# EAGLE design EAT0004 (EAGLE 7.2.0)
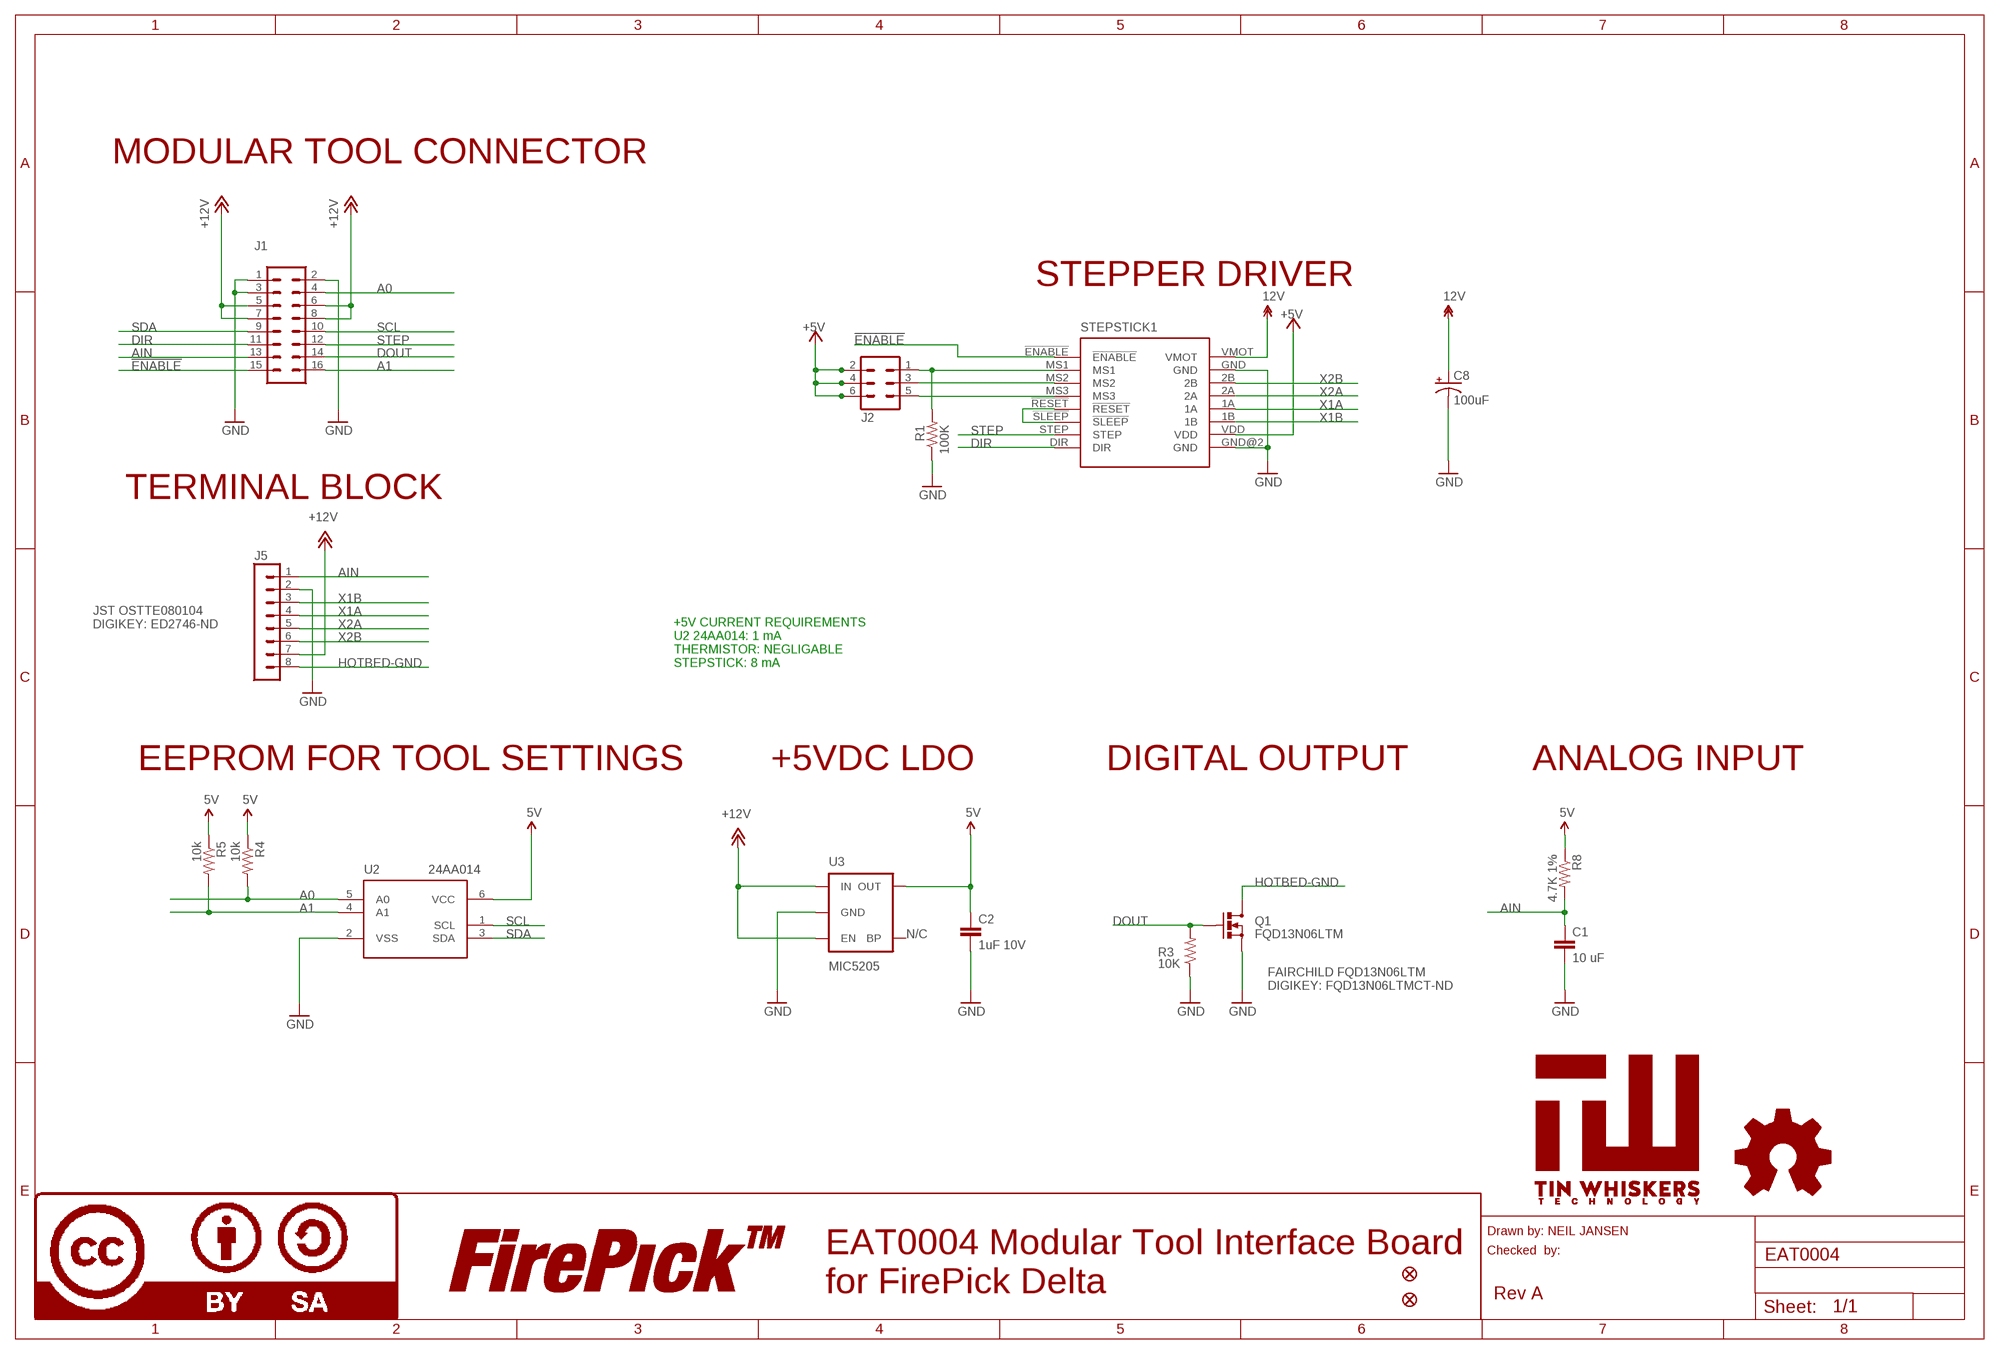
[diagram p0: schematic, sheet 1]

## Parts
C1  10 uF  CAP0805  [0805]
C2  1uF 10V  CAP0805  [0805]
C8  100uF  CPOL-USD  [PANASONIC_D]
FID1  FIDUCIAL  [FIDUCIAL]
FID2  FIDUCIAL  [FIDUCIAL]
J1  CONN-RECT-16PIN-2ROWSIDE  [CONN-RECT-2.54MM-16PIN-2ROW-SIDE]
J2  MA03-2  [MA03-2]
J5  CONN-OSTTE1201X4  [CONN-OSTTE1201X4]
LOGO1  LOGO-OSHWSMALL  [LOGO-OSHW-SMALL]
LOGO4  LOGO-FIREPICKMEDIUM  [LOGO-FIREPICK-MEDIUM]
LOGO6  LOGO-CC-BY-SAMEDIUM  [LOGO-CC-BY-SA-MEDIUM]
Q1  FQD13N06LTM  MOSFET-NCHANNELFDD8580  [DPAK]
R1  100K  RESISTOR0805-RES  [0805]
R3  10K  RESISTOR0805-RES  [0805]
R4  10k  RESISTOR0805-RES  [0805]
R5  10k  RESISTOR0805-RES  [0805]
R8  4.7K 1%  RESISTOR0805-RES  [0805]
STEPSTICK1  STEPSTICK  [STEPSTICK]
U2  24AA014  IC-24AA014  [SOT23-6]
U3  MIC5205  MIC52055V  [SOT23-5]
U$3  TIN-WHISKERSSMALL  [TIN-WHISKERS-SMALL]

## Nets
5V [power]: C2.1 J2.2 J2.4 J2.6 R4.1 R5.1 R8.1 STEPSTICK1.VDD U2.6(VCC) U3.5(OUT) ; supply symbol labelled +5V
!ENABLE: J1.15 STEPSTICK1.!ENABLE!
+12V [power-12V]: C8.+ J1.5 J1.6 J1.7 J1.8 J5.7 STEPSTICK1.VMOT U3.1(IN) U3.3(EN) ; supply symbol labelled 12V
A0: J1.4 R4.2 U2.5(A0)
A1: J1.16 R5.2 U2.4(A1)
AIN: C1.1 J1.13 J5.1 R8.2
DIR: J1.11 STEPSTICK1.DIR
DOUT: J1.14 Q1.1(G) R3.2
GND: C1.2 C2.2 C8.- J1.1 J1.2 J1.3 J5.2 Q1.3(S) R1.1 R3.1 STEPSTICK1.GND STEPSTICK1.GND@2(GND) U2.2(VSS) U3.2(GND)
HOTBED-GND [power-12V]: J5.8 Q1.4(D)
N$11: STEPSTICK1.!RESET! STEPSTICK1.!SLEEP!
SCL: J1.10 U2.1(SCL)
SDA: J1.9 U2.3(SDA)
STEP: J1.12 STEPSTICK1.STEP
X1A: J5.4 STEPSTICK1.1A
X1B: J5.3 STEPSTICK1.1B
X2A: J5.5 STEPSTICK1.2A
X2B: J5.6 STEPSTICK1.2B
X_MS1: J2.1 R1.2 STEPSTICK1.MS1
X_MS2: J2.3 STEPSTICK1.MS2
X_MS3: J2.5 STEPSTICK1.MS3
Unconnected: U3.4(BP)

## Notes on the sheet
- MODULAR TOOL CONNECTOR
- STEPPER DRIVER
- TERMINAL BLOCK
- JST OSTTE080104
  DIGIKEY: ED2746-ND
- +5V CURRENT REQUIREMENTS
  U2 24AA014: 1 mA
  THERMISTOR: NEGLIGABLE
  STEPSTICK: 8 mA
- EEPROM FOR TOOL SETTINGS | +5VDC LDO | DIGITAL OUTPUT | ANALOG INPUT
- N/C
- FAIRCHILD FQD13N06LTM
  DIGIKEY: FQD13N06LTMCT-ND
- Drawn by: NEIL JANSEN
- Checked  by:
- EAT0004 Modular Tool Interface Board
  for FirePick Delta
- Rev A

## Library data of the parts
C1 = SparkFun-Capacitors:CAP: Capacitor Standard 0603 ceramic capacitor, and 0.1" leaded capacitor.; PARTNO: CC0805ZKY5V6BB106
C2 = SparkFun-Capacitors:CAP: Capacitor Standard 0603 ceramic capacitor, and 0.1" leaded capacitor.; PARTNO: CC0805KKX7R7BB105
C8 = rcl:CPOL-US: POLARIZED CAPACITOR, American symbol; PARTNO: 25TXV100M6.3X8
FID1 FID2 = FirePick:FIDUCIAL; DNP: T
J1 = FirePick:CONN-RECT-16PIN-2ROW; PARTNO: CONN-0.1-S-2x8
J2 = !con-lstb:MA03-2: PIN HEADER; PARTNO: CONN-0.1-S-2X3
J5 = FirePick:CONN-OSTTE1201X4; PARTNO: OSTTE080104
LOGO1 = FirePick:LOGO-OSHW; BOM: EXCLUDE; DNP: T
LOGO4 = FirePick:LOGO-FIREPICK; BOM: EXCLUDE; DNP: T
LOGO6 = FirePick:LOGO-CC-BY-SA; BOM: EXCLUDE; DNP: T
Q1 = SparkFun:MOSFET-NCHANNEL; PARTNO: FQD13N06LTM
R1 = SparkFun-Resistors:RESISTOR: Resistor Basic schematic elements and footprints for 0603, 1206, and PTH resistors.; PARTNO: RC0805FR-07100KL
R3-R5 = SparkFun-Resistors:RESISTOR: Resistor Basic schematic elements and footprints for 0603, 1206, and PTH resistors.; PARTNO: RC0805FR-0710KL
R8 = SparkFun-Resistors:RESISTOR: Resistor Basic schematic elements and footprints for 0603, 1206, and PTH resistors.; PARTNO: RC0805FR-074K7L
STEPSTICK1 = FirePick:STEPSTICK; PARTNO: STEPSTICK
U2 = FirePick:IC-24AA014; PARTNO: 24AA014T-I/OT
U3 = SparkFun-PowerIC:MIC5205: MIC5205 150mA vreg 3.3V - VREG-00822 5V - VREG-00823; PARTNO: MIC5205-5.0YM5 TR; PROD_ID: VREG-00823
U$3 = !tin-whiskers:TIN-WHISKERS

## Net classes
0 default: width 0.3 mm, drill 0.3 mm, clearance 0.3 mm
1 power: width 0.3 mm, drill 0.3 mm, clearance 0.3 mm
2 power-12V: width 0.3 mm, drill 0.3 mm, clearance 0.3 mm

## Board
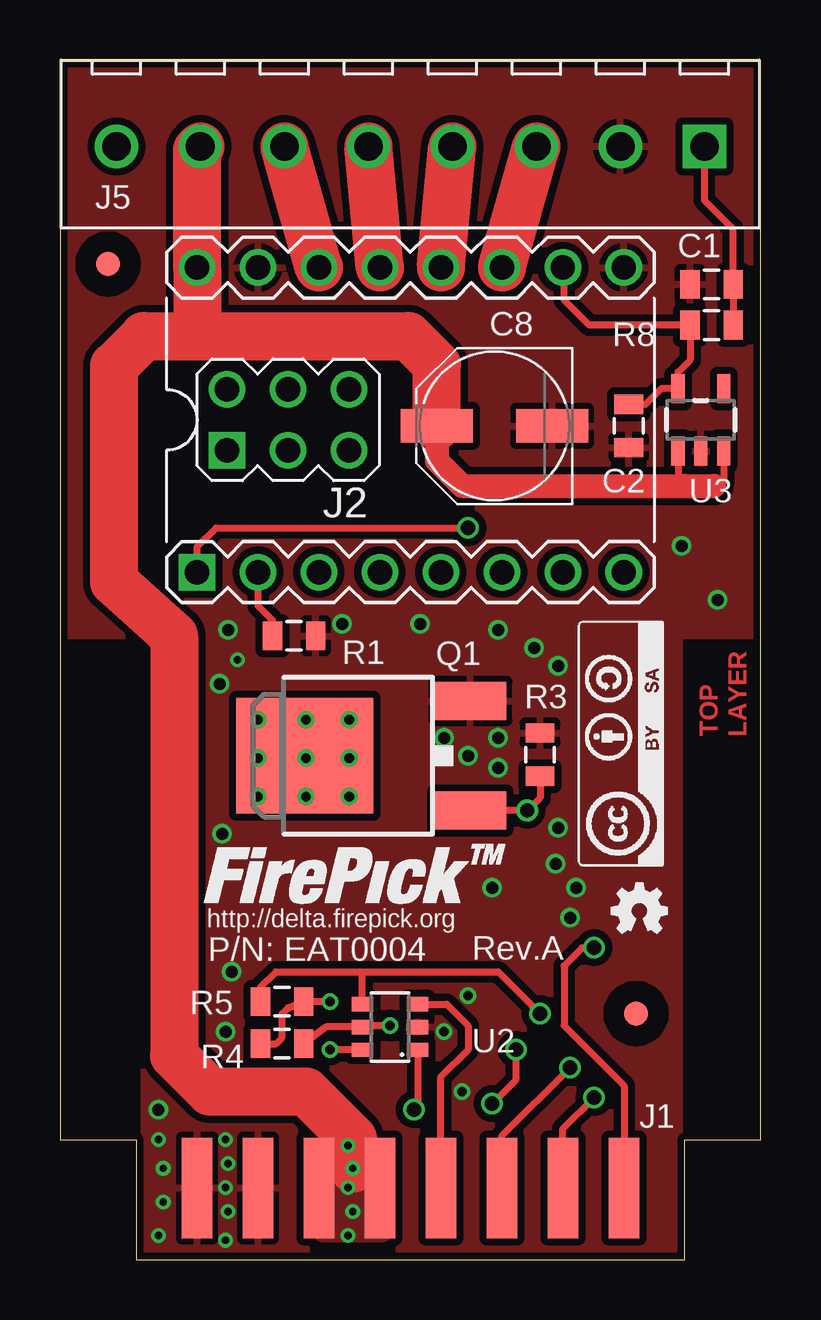
[diagram p1: board, top side]
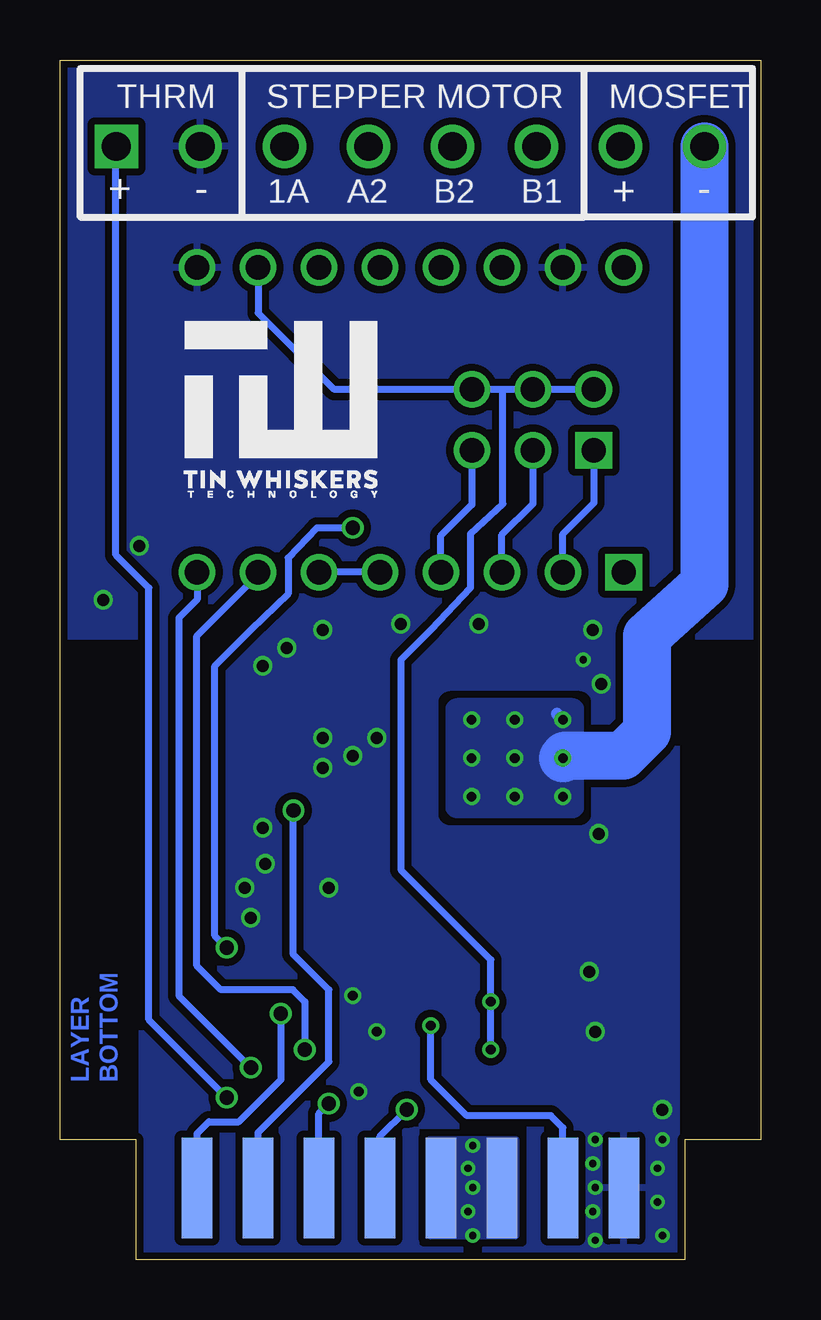
[diagram p2: board, bottom side, seen from below]

Size 29.2 x 50 mm. Coordinates in mm from the lower left corner, seen from the top.
Outline: 3.17,0 26.03,0 26.03,5 29.2,5 29.2,50 0,50 0,5 3.17,5 3.17,0
Copper layers (1*16): Top 0.035mm / dielectric 1.5mm / Bottom 0.035mm
Design rules "SeeedStudio_2layer_DRU_no_angle_20140221": minimum track width 6mil, minimum drill 12mil, track to track 6mil, track to pad 6mil, pad to pad 6mil, via to via 6mil, smd to smd 0mil, copper to edge 10mil, drill to drill 10mil, minimum pad ring 10mil, minimum via ring 6mil, stop-mask expansion 2mil, vias tented up to drill 100mil, thermal gap 10mil

### Footprints (pad centres in the part's own frame; a part is rotated, then mirrored left to right if it is on the bottom)
0805 = smd 0.8 x 1.2: 1 -0.9,0; 2 0.9,0
PANASONIC_D = smd 3 x 1.4: + 2.4,0; - -2.4,0
FIDUCIAL = smd 1 x 1: 1 0,0
CONN-RECT-2.54MM-16PIN-2ROW-SIDE = smd 1.27 x 4.2: 1 -8.89,-0.02; 3 -6.35,-0.02; 5 -3.81,-0.02; 7 -1.27,-0.02; 9 1.27,-0.02; 11 3.81,-0.02; 13 6.35,-0.02; 15 8.89,-0.02 | smd 1.27 x 4.2 bottom: 2 -8.89,-0.02; 4 -6.35,-0.02; 6 -3.81,-0.02; 8 -1.27,-0.02; 10 1.27,-0.02; 12 3.81,-0.02; 14 6.35,-0.02; 16 8.89,-0.02
MA03-2 = drill 1.016 square: 1 -2.54,-1.27 | drill 1.016: 2 -2.54,1.27; 3 0,-1.27; 4 0,1.27; 5 2.54,-1.27; 6 2.54,1.27
CONN-OSTTE1201X4 = drill 1.2 square: 1 -12.25,0 | drill 1.2: 2 -8.75,0; 3 -5.25,0; 4 -1.75,0; 5 1.75,0; 6 5.25,0; 7 8.75,0; 8 12.25,0
DPAK = smd 1.6 x 3: 1 -2.28,-5.31; 3 2.28,-5.31 | smd 4.826 x 5.715: 4 0,1.588
STEPSTICK = drill 1.016: 1A 6.35,-1.27; 1B 6.35,-3.81; 2A 6.35,1.27; 2B 6.35,3.81; !RESET! -6.35,-1.27; !SLEEP! -6.35,-3.81; DIR -6.35,-8.89; GND 6.35,6.35; GND@2 6.35,-8.89; MS1 -6.35,6.35; MS2 -6.35,3.81; MS3 -6.35,1.27; STEP -6.35,-6.35; VDD 6.35,-6.35; VMOT 6.35,8.89 | drill 1.016 square: !ENABLE! -6.35,8.89
SOT23-6 = smd 0.6 x 0.9: 1 -0.95,-1.15; 2 0,-1.15; 3 0.95,-1.15; 4 0.95,1.15; 5 0,1.15; 6 -0.95,1.15
SOT23-5 = smd 0.55 x 1.2: 1 -0.95,-1.3; 2 0,-1.3; 3 0.95,-1.3; 4 0.95,1.3; 5 -0.95,1.3

### Placement (x,y rotation side)
C1  27.15,40.65 180 top
C2  23.7,34.75 270 top
C8  18.1,34.75 180 top
FID1  2,41.5 0 top
FID2  24,10.25 0 top
J1  14.6,3 0 top
J2  9.5,35 0 top
J5  14.6,46.4 180 top
LOGO1  22.9,13.4 0 top
LOGO4  6,14.85 0 top
LOGO6  25.15,16.4 90 top
Q1  11.79,21 90 top
R1  9.75,26 180 top
R3  20,21.05 270 top
R4  9.25,9 0 top
R5  9.25,10.75 180 top
R8  27.15,38.95 0 top
STEPSTICK1  14.6,35 90 top
U2  13.75,9.69 90 top
U3  26.7,35 0 top
U$3  24.5,31.5 0 bottom

### Tracks (layer width: path | path; a pad name or v marks a point on that pad's centre or on a via)
5V  (via drill 0.4)
  Top 0.3: STEPSTICK1.VDD 21,41.3 21,40 22.05,38.95 R8.1 26.25,37.5 25.75,37 U3.5 25.05,36.3 24.4,35.65 C2.1 | R4.1 9,9 9.25,9.25 9.25,10.25 9.5,10.5 R5.1 v11.25,10.75 | U2.6 11.51,8.74 v11.25,8.75
  Bottom 0.3: v11.25,8.75 v11.25,10.75 11.25,12.5 15,16.25 15,25 13.75,26.25 12.1,28 12.1,30.25 10.75,31.5 10.75,36.27 | STEPSTICK1.VDD 20.95,39.45 17.77,36.27 J2.6 10.75,36.27 | J2.2 J2.4 10.75,36.27
!ENABLE  (via drill 0.6)
  Top 0.3: STEPSTICK1.!ENABLE! 5.71,29.71 6.5,30.5 v17,30.5 | J1.15 23.5,7.25 21,9.75 21,12.25 21.75,13 v22.25,13
  Bottom 0.3: v17,30.5 18.5,30.5 19.7,29.25 19.7,27.75 21.25,26.25 22.75,24.75 22.75,13.5 v22.25,13
+12V  (via drill 0.3)
  Top 0.3: U3.3 27.65,32.4 27.25,32.25 | U3.1 25.75,32.5 26,32.25
  Top 1: C8.+ 15.7,33.3 16.75,32.25 26,32.25 27.25,32.25
  Top 2: J5.7 5.71,46.26 STEPSTICK1.VMOT 5.71,38.54 5.75,38.5 | 5.75,38.5 3.5,38.5 2.25,37.25 2.25,28.25 4.75,26 4.75,8.5 6.25,7 10.25,7 12.2,5.05 v12.2,3.8 | 5.75,38.5 14.5,38.5 15.7,37.3 C8.+
  other vias: 12,3 12.2,2 12,1 12,4.75
  pour Top (isolate 0.3, no thermals): 11,4.4 13.4,4.4 13.4,1.2 11,1.2
  pour Bottom (no thermals): 10.2,5 13.8,5 13.8,1 10.2,1
A0  (via drill 0.4)
  Top 0.3: R4.2 11.09,9.69 U2.5 12.66,9.75 v13.75,9.75
  Bottom 0.3: J1.4 8.25,5.5 8.75,6 12.25,6 13.75,7.5 v13.75,9.75
A1  (via drill 0.6)
  Top 0.3: 12.5,12 9,12 8.35,11.35 R5.2 | 12.5,12 18.25,12 v20,10.25 | U2.4 12.6,11.9 12.5,12
  Bottom 0.3: J1.16 23.49,5.26 23,5.75 21.75,5.75 20,7.5 v20,10.25
AIN  (via drill 0.6)
  Top 0.3: R8.2 C1.1 28.05,42.95 26.85,44.15 J5.1 | J1.13 20.95,5.45 v22.25,6.75
  Bottom 0.3: J5.1 26.88,46.38 26.88,29.38 25.5,28 25.5,10 v22.25,6.75
DIR  (via drill 0.6)
  Top 0.3: 18.39,3 J1.11 18.41,5.16 v21.25,8
  Bottom 0.3: STEPSTICK1.DIR 23.49,27.51 24.25,26.75 24.25,11 v21.25,8
DOUT  (via drill 0.6)
  Top 0.3: R3.2 20,19.25 v19.47,18.72 Q1.1
  Bottom 0.3: J1.14 20.95,5.3 18,8.25 18,11.25 19.5,12.75 19.5,18.69 v19.47,18.72
GND  (via drill 0.3, 0.4, 0.5)
  other vias: 6.9,5 4.3,3.8 6.9,3 7,2 6.9,0.8 7,4 4.1,1 4.3,2.4 4.1,5 6.75,17.75 11.75,26.5 18.25,26.25 21.5,15.5 19.75,25.5 16,21.75 17,21 18.25,21.75 18.25,20.5 20.75,18 18,15.5 20.75,24.75 7,26.25 17,11 16.75,7 16,9.5 6.65,24 6.9,9.5 25.9,29.75 20.65,16.5 7.4,25 4.1,6.25 7.15,12 27.4,27.5 21.25,14.25 15,26.5
  pour Top (isolate 0.3, rank 2): 0,50 29.1,50 29.1,26 25.8,26 25.8,0 3.5,0 3.5,26 0,26
  pour Bottom (isolate 0.3, rank 2): 29.1,50 29.1,26 25.8,26 25.8,0.2 3.5,0.2 3.5,26 0,26 0,50
HOTBED-GND  (via drill 0.4)
  Top 0.3: Q1.4 10.2,20.95 v10.25,20.9
  Bottom 0.5: 8.5,22.75 v8.25,22.5
  Bottom 2: J5.8 2.35,28.15 4.75,26 4.75,22 5.75,21 8.15,21 v8.25,20.9
  other vias: 12.05,22.5 12.05,19.3 8.25,19.3 10.25,22.5 10.25,19.3 12.05,20.9
  pour Bottom (isolate 0.5): 12.65,18.9 7.85,18.9 7.85,22.9 12.65,22.9
N$11
  Bottom 0.3: STEPSTICK1.!RESET! STEPSTICK1.!SLEEP!
SCL  (via drill 0.6)
  Top 0.3: U2.1 14.9,6.4 v14.75,6.25
  Bottom 0.3: J1.10 15.87,5.13 v14.75,6.25
SDA
  Top 0.3: U2.3 16.11,10.64 17,9.75 17,8.75 15.87,7.62 J1.9
STEP  (via drill 0.6)
  Top 0.3: v18,6.5 19,7.5 v19,8.75
  Bottom 0.3: STEPSTICK1.STEP 20.95,28.55 23.5,26 23.5,12.25 22.5,11.25 19.5,11.25 19,10.75 v19,8.75 | J1.12 18.41,6.09 v18,6.5
X1A
  Top 2: STEPSTICK1.1A J5.4
X1B
  Top 2: STEPSTICK1.1B J5.3
X2A
  Top 2: STEPSTICK1.2A J5.5
X2B
  Top 2: STEPSTICK1.2B J5.6
X_MS1
  Top 0.3: R1.2 8.85,26.65 8.25,27.25 STEPSTICK1.MS1
  Bottom 0.3: STEPSTICK1.MS1 8.25,30.25 6.96,31.54 J2.1
X_MS2
  Bottom 0.3: STEPSTICK1.MS2 10.79,30.21 9.5,31.5 J2.3
X_MS3
  Bottom 0.3: STEPSTICK1.MS3 13.33,30.17 12.04,31.46 J2.5

### Text on the board
Top: TOP | LAYER
Bottom: BOTTOM | LAYER
tPlace: http://delta.firepick.org | P/N: EAT0004 | Rev.A
bPlace: MOSFET | STEPPER MOTOR | THRM | - | + | B1 | B2 | A2 | 1A | - | +